# EAGLE design control_board_SMD (EAGLE 8.3.1)
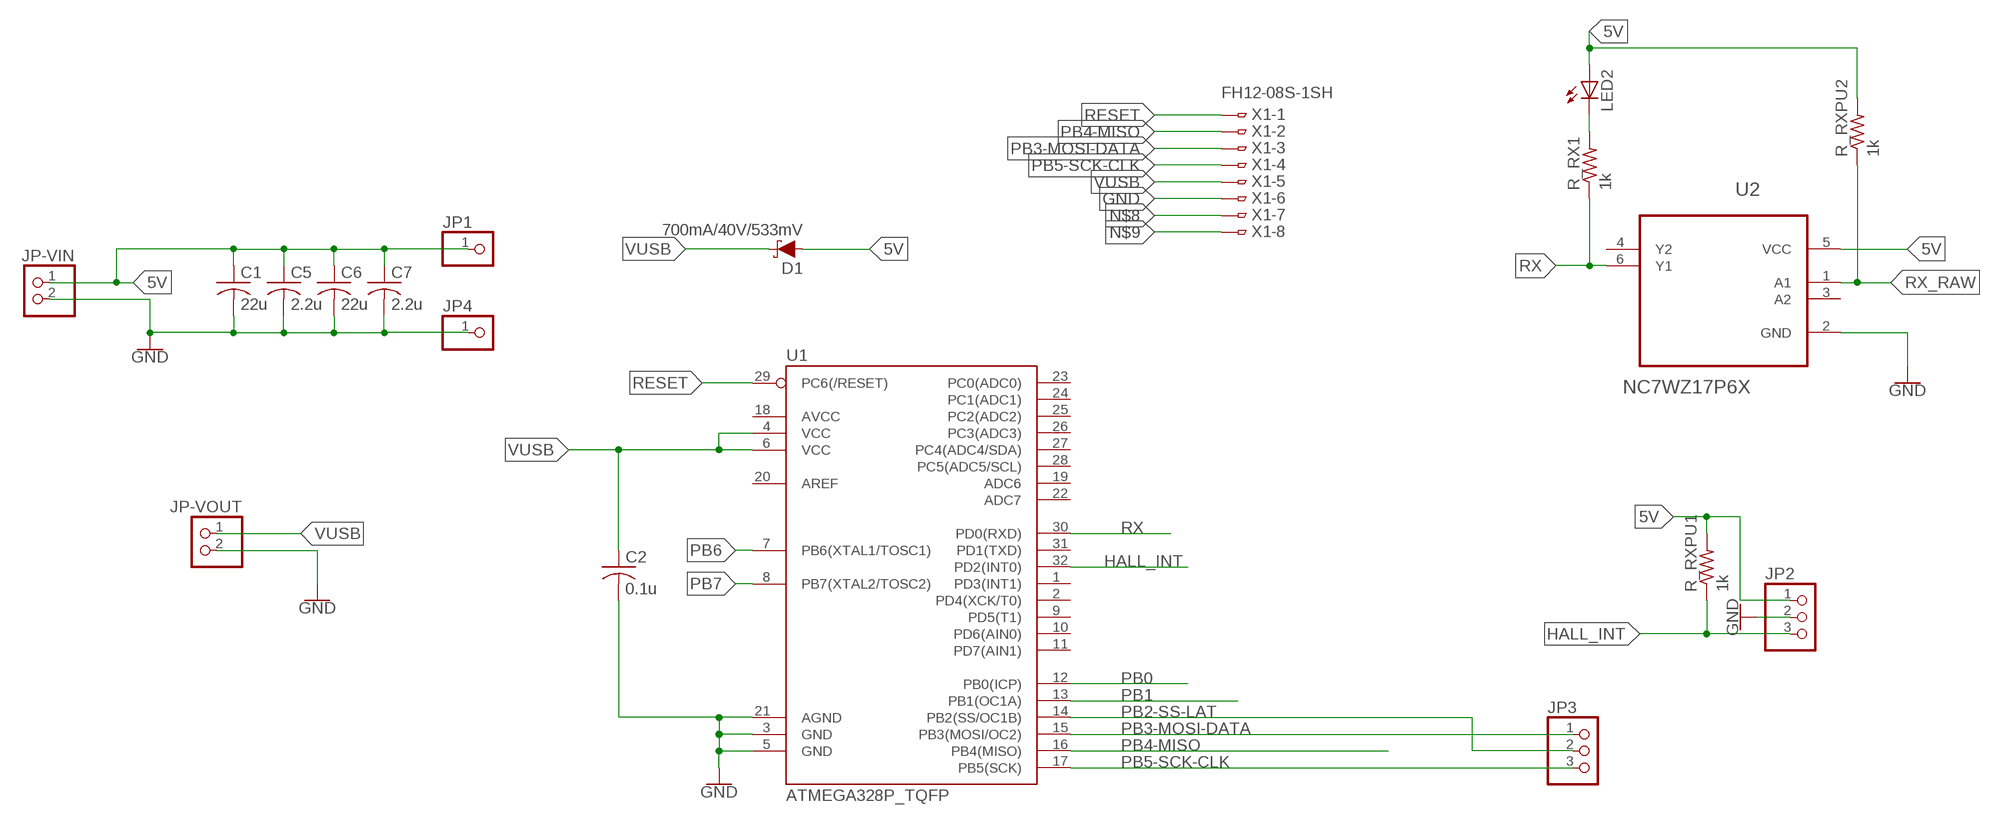
[diagram p0: schematic, sheet 1]

## Parts
C1  22u  C-USC1210  [C1210]
C2  0.1u  C-USC0603  [C0603]
C5  2.2u  C-USC1210  [C1210]
C6  22u  C-USC1210  [C1210]
C7  2.2u  C-USC1210  [C1210]
D1  700mA/40V/533mV  DIODE-SCHOTTKY-ZLLS500  [SOT23-3]
JP1  PINHD-1X1  [1X01]
JP2  PINHD-1X3  [1X03]
JP3  PINHD-1X3  [1X03]
JP4  PINHD-1X1  [1X01]
JP-VIN  PINHD-1X2  [1X02]
JP-VOUT  PINHD-1X2  [1X02]
LED2  LEDCHIPLED_0603  [CHIPLED_0603]
R_RX1  1k  R-US_R0603  [R0603]
R_RXPU1  1k  R-US_R0603  [R0603]
R_RXPU2  1k  R-US_R0603  [R0603]
U1  ATMEGA328P_TQFP  [TQFP32-08]
U2  NC7WZ17P6X  [SOT65P210X110-6N]
X1  FH12-08S-1SH  [FH12-08S-1SH]

## Nets
5V: C1.1 C5.1 C6.1 C7.1 D1.1(A) JP1.1 JP2.1 JP-VIN.1 LED2.A R_RXPU1.2 R_RXPU2.2 U2.5(VCC)
GND: C1.2 C2.2 C5.2 C6.2 C7.2 JP2.2 JP4.1 JP-VIN.2 JP-VOUT.2 U1.3(GND) U1.5(GND) U1.21(AGND) U2.2(GND) X1.6
HALL_INT: JP2.3 R_RXPU1.1 U1.32(PD2(INT0))
N$2: LED2.C R_RX1.2
N$8: X1.7
N$9: X1.8
PB0: U1.12(PB0(ICP))
PB1: U1.13(PB1(OC1A))
PB2-SS-LAT: JP3.2 U1.14(PB2(SS/OC1B))
PB3-MOSI-DATA: JP3.1 U1.15(PB3(MOSI/OC2)) X1.3
PB4-MISO: U1.16(PB4(MISO)) X1.2
PB5-SCK-CLK: JP3.3 U1.17(PB5(SCK)) X1.4
PB6: U1.7(PB6(XTAL1/TOSC1))
PB7: U1.8(PB7(XTAL2/TOSC2))
RESET: U1.29(PC6(/RESET)) X1.1
RX: R_RX1.1 U1.30(PD0(RXD)) U2.6(Y1)
RX_RAW: R_RXPU2.1 U2.1(A1)
VUSB: C2.1 D1.3(C) JP-VOUT.1 U1.4(VCC) U1.6(VCC) X1.5
Unconnected: U1.1(PD3(INT1)) U1.2(PD4(XCK/T0)) U1.9(PD5(T1)) U1.10(PD6(AIN0)) U1.11(PD7(AIN1)) U1.18(AVCC) U1.19(ADC6) U1.20(AREF) U1.22(ADC7) U1.23(PC0(ADC0)) U1.24(PC1(ADC1)) U1.25(PC2(ADC2)) U1.26(PC3(ADC3)) U1.27(PC4(ADC4/SDA)) U1.28(PC5(ADC5/SCL)) U1.31(PD1(TXD)) U2.3(A2) U2.4(Y2)

## Library data of the parts
C1 C2 C5-C7 = adafruit:C-US: CAPACITOR, American symbol
D1 = SparkFun-DiscreteSemi:DIODE-SCHOTTKY: Schottky diode A Schottky diode is a semiconductor diode which has a low forward voltage drop and a very fast switching action.; PROD_ID: DIO-08411
JP1 JP4 = pinhead:PINHD-1X1: PIN HEADER
JP2 JP3 = pinhead:PINHD-1X3: PIN HEADER
JP-VIN JP-VOUT = pinhead:PINHD-1X2: PIN HEADER
LED2 = adafruit:LED: LED OSRAM: - CHIPLED LG R971, LG N971, LY N971, LG Q971, LY Q971, LO R971, LY R971 LH N974, LH R974 LS Q976, LO Q976, LY Q976 LO Q996 - Hyper CHIPLED LW Q18S LB Q993, LB Q99A, LB R99A - SideLED LS A670, LO A670, LY A670, LG A670, LP A670 LB A673, LV A673, LT A673, LW A673 LH A674 LY A675 LS A676, LA A676, LO A676, LY A676, LW A676 LS A679, LY A679, LG A679 - Hyper Micro SIDELED® LS Y876, LA Y876, LO Y876, LY Y876 LT Y87S - SmartLED LW L88C, LW L88S LB L89C, LB L89S, LG L890 LS L89K, LO L89K, LY L89K LS L896, LA L896, LO L896, LY L896 - TOPLED LS T670, LO T670, LY T670, LG T670, LP T670 LSG T670, LSP T670, LSY T670, LOP T670, LYG T670 LG T671, LOG T671, LSG T671 LB T673, LV T673, LT T673, LW T673 LH T674 LS T676, LA T676, LO T676, LY T676, LB T676, LH T676, LSB T676, LW T676 LB T67C, LV T67C, LT T67C, LS T67K, LO T67K, LY T67K, LW E67C LS E67B, LA E67B, LO E67B, LY E67B, LB E67C, LV E67C, LT E67C LW T67C LS T679, LY T679, LG T679 LS T770, LO T770, LY T770, LG T770, LP T770 LB T773, LV T773, LT T773, LW T773 LH T774 LS E675, LA E675, LY E675, LS T675 LS T776, LA T776, LO T776, LY T776, LB T776 LHGB T686 LT T68C, LB T68C - Hyper Mini TOPLED® LB M676 - Mini TOPLED Santana® LG M470 LS M47K, LO M47K, LY M47K Source: http://www.osram.convergy.de/
R_RX1 R_RXPU1 R_RXPU2 = adafruit:R-US_: RESISTOR, American symbol
U1 = SparkFun-IC-Microcontroller:ATMEGA328P_TQFP: Popular 328P in QFP Storefront component: ATmega328 - TQFP <https://www.sparkfun.com/products/13448> (COM-13448) Datasheet <http://www.sparkfun.com/datasheets/Components/SMD/ATMega328.pdf> SparkFun Products SparkFun RedBoard - Programmed with Arduino <https://www.sparkfun.com/products/12757> (DEV-12757) Arduino Pro Mini 328 - 5V/16MHz <https://www.sparkfun.com/products/11113> (DEV-11113) Arduino Pro Mini 328 - 3.3V/8MHz <https://www.sparkfun.com/products/11114> (DEV-11114) SparkFun OpenLog <https://www.sparkfun.com/products/13712> (DEV-13712) SparkFun MicroView - OLED Arduino Module <https://www.sparkfun.com/products/12923> (DEV-12923) SparkFun Digital Sandbox <https://www.sparkfun.com/products/12651> (DEV-12651) SparkFun PicoBoard <https://www.sparkfun.com/products/11888> (WIG-11888) Arduino Fio <https://www.sparkfun.com/products/10116> (DEV-10116) LilyPad Arduino 328 Main Board <https://www.sparkfun.com/products/13342> (DEV-13342) SparkFun RedStick <https://www.sparkfun.com/products/13741> (DEV-13741) LilyPad MP3 <https://www.sparkfun.com/products/11013> (DEV-11013) LilyPad Arduino SimpleSnap <https://www.sparkfun.com/products/10941> (DEV-10941) SparkFun Stepoko <https://www.sparkfun.com/products/13899> (ROB-13899) SparkFun Geiger Counter <https://www.sparkfun.com/products/11345> (SEN-11345) SparkFun EL Sequencer <https://www.sparkfun.com/products/12781> (COM-12781) Arduino Pro 328 - 5V/16MHz <https://www.sparkfun.com/products/10915> (DEV-10915) CryptoCape <https://www.sparkfun.com/products/12773> (DEV-12773) SparkFun IR Thermometer Evaluation Board - MLX90614 <https://www.sparkfun.com/products/10740> (SEN-10740) SparkFun RedBot Mainboard <https://www.sparkfun.com/products/12097> (ROB-12097) Arduino Pro 328 - 3.3V/8MHz <https://www.sparkfun.com/products/10914> (DEV-10914) SparkFun Block for Intel® Edison - Arduino <https://www.sparkfun.com/products/13036> (DEV-13036) SparkFun Simon Says - Surface Mount Soldering Kit <https://www.sparkfun.com/products/10935> (KIT-10935) SparkFun 7-Segment Serial Display - Red <https://www.sparkfun.com/products/11441> (COM-11441) SparkFun 7-Segment Serial Display - White <https://www.sparkfun.com/products/11629> (COM-11629) SparkFun 7-Segment Serial Display - Yellow <https://www.sparkfun.com/products/11443> (COM-11443) SparkFun 7-Segment Serial Display - Kelly Green <https://www.sparkfun.com/products/11440> (COM-11440) SparkFun 7-Segment Serial Display - Blue <https://www.sparkfun.com/products/11442> (COM-11442) SparkFun OpenSegment Serial Display - 20mm (Blue) <https://www.sparkfun.com/products/11647> (COM-11647) SparkFun OpenSegment Serial Display - 20mm (Green) <https://www.sparkfun.com/products/11646> (COM-11646) SparkFun OpenSegment Serial Display - 20mm (White) <https://www.sparkfun.com/products/11648> (COM-11648) SparkFun OpenSegment Serial Display - 20mm (Red) <https://www.sparkfun.com/products/11644> (COM-11644) SparkFun OpenSegment Serial Display - 20mm (Yellow) <https://www.sparkfun.com/products/11645> (COM-11645) SparkFun OpenSegment Shield <https://www.sparkfun.com/products/13190> (DEV-13190); PROD_ID: IC-09069
U2 = NC7WZ17P6X:NC7WZ17P6X: Dual Buffer; AVAILABILITY: Good; DESCRIPTION: NC7WZ17 Series 5.5 V TinyLogic UHS Dual Buffer w/ Schmitt Trigger Inputs-SC-70-6; MF: Fairchild Semiconductor; MP: NC7WZ17P6X; PACKAGE: SC-70-6 Fairchild Semiconductor; PRICE: 0.10 USD
X1 = con-hirose:FH12-08S-1S: 1mm Pitch Connectors For FPC/FFC Source: Data sheet <http://www.hirose.co.jp/cataloge_hp/e58605370.pdf>; OC_FARNELL: unknown; OC_NEWARK: unknown

## Board
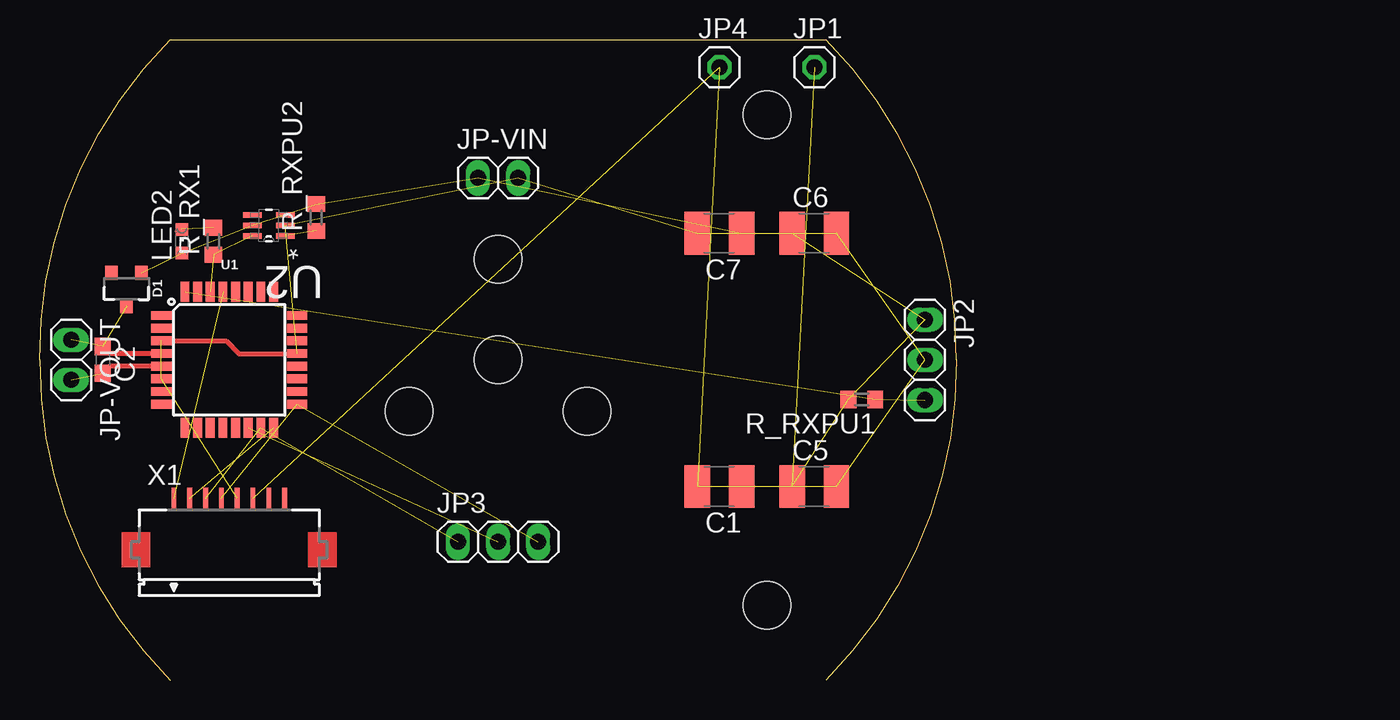
[diagram p1: board, top side]
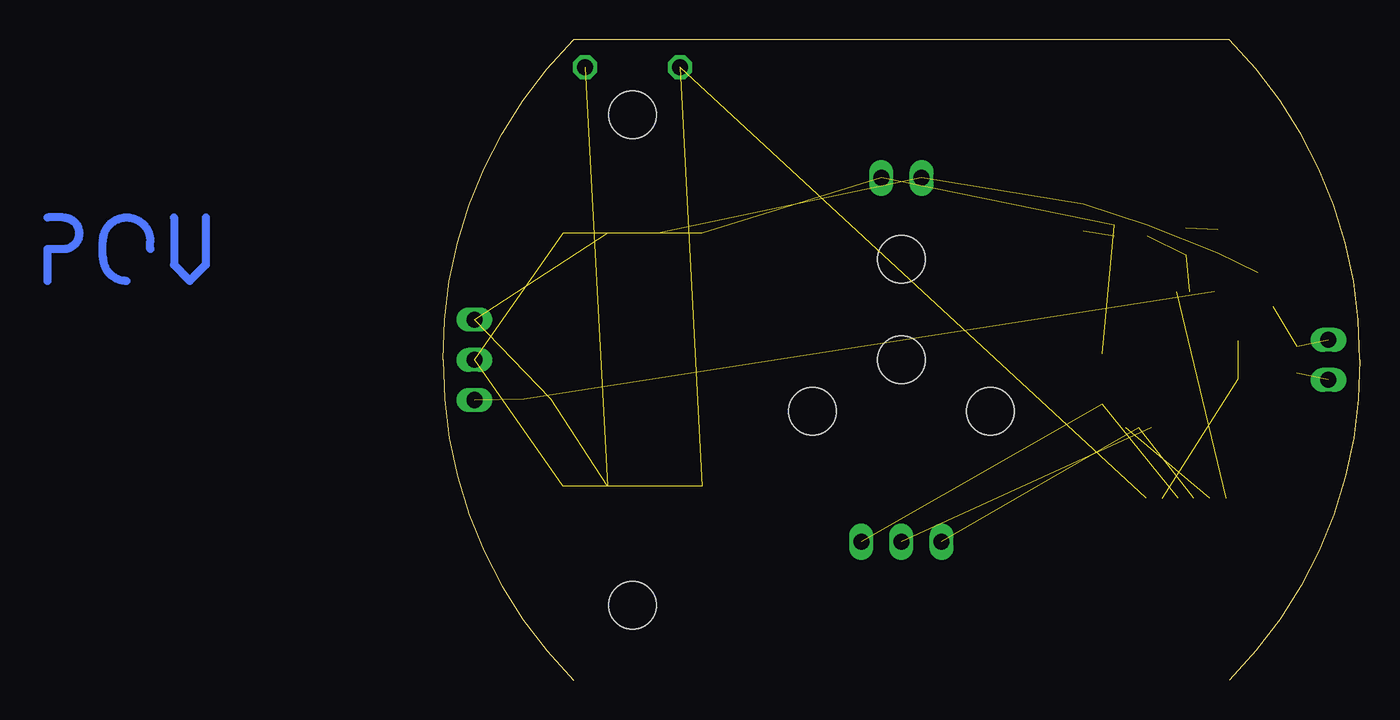
[diagram p2: board, bottom side, seen from below]

Size 58 x 40.5 mm. Coordinates in mm from the lower left corner, seen from the top.
Outline: 8.25,0 arc-45 0,20.25 arc-45 8.25,40.5 49.75,40.5 arc-45 58,20.25 arc-45 49.75,0
Copper layers (1*16): Top 0.035mm / dielectric 1.5mm / Bottom 0.035mm
Design rules "OthermillDRC_1_32_v2": minimum track width 8mil, minimum drill 0.8mm, track to track 0.794003125mm, track to pad 0.794003125mm, pad to pad 0.794003125mm, via to via 0.794003125mm, smd to smd 0mil, copper to edge 0mil, drill to drill 1mil, minimum pad ring 10mil, minimum via ring 10mil, stop-mask expansion 1mil, vias tented up to drill 30mil, thermal gap 10mil
Holes 3 mm at 29,20.25 29,26.6 34.63,17 23.37,17 46,35.75 46,4.75

### Footprints (pad centres in the part's own frame; a part is rotated, then mirrored left to right if it is on the bottom)
C1210 = smd 1.6 x 2.7: 1 -1.4,0; 2 1.4,0
C0603 = smd 1.1 x 1: 1 -0.85,0; 2 0.85,0
SOT23-3 = smd 0.8 x 0.9: 1 -0.95,-1; 2 0.95,-1; 3 0,1.1
1X01 = drill 1.016 octagon: 1 0,0
1X03 = drill 1.016 long: 1 -2.54,0; 2 0,0; 3 2.54,0
1X02 = drill 1.016 long: 1 -1.27,0; 2 1.27,0
CHIPLED_0603 = smd 0.8 x 0.8: A 0,-0.75; C 0,0.75
R0603 = smd 1 x 1.1: 1 -0.85,0; 2 0.85,0
TQFP32-08 = smd 1.27 x 0.559: 1 -4.293,2.8; 2 -4.293,2; 3 -4.293,1.2; 4 -4.293,0.4; 5 -4.293,-0.4; 6 -4.293,-1.2; 7 -4.293,-2; 8 -4.293,-2.8; 17 4.293,-2.8; 18 4.293,-2; 19 4.293,-1.2; 20 4.293,-0.4; 21 4.293,0.4; 22 4.293,1.2; 23 4.293,2; 24 4.293,2.8 | smd 0.559 x 1.27: 9 -2.8,-4.293; 10 -2,-4.293; 11 -1.2,-4.293; 12 -0.4,-4.293; 13 0.4,-4.293; 14 1.2,-4.293; 15 2,-4.293; 16 2.8,-4.293; 25 2.8,4.293; 26 2,4.293; 27 1.2,4.293; 28 0.4,4.293; 29 -0.4,4.293; 30 -1.2,4.293; 31 -2,4.293; 32 -2.8,4.293
SOT65P210X110-6N = smd 1.168 x 0.356: 1 -1.041,0.66; 2 -1.041,0; 3 -1.041,-0.66; 4 1.041,-0.66; 5 1.041,0; 6 1.041,0.66
FH12-08S-1SH = smd 0.3 x 1.3: 1 -3.5,3.25; 2 -2.5,3.25; 3 -1.5,3.25; 4 -0.5,3.25; 5 0.5,3.25; 6 1.5,3.25; 7 2.5,3.25; 8 3.5,3.25

### Placement (x,y rotation side)
C1  43,12.25 180 top
C2  4,20.25 270 top
C5  49,12.25 0 top
C6  49,28.25 0 top
C7  43,28.25 180 top
D1  5.5,24.75 180 top
JP1  49,38.75 0 top
JP2  56,20.25 270 top
JP3  29,8.75 0 top
JP4  43,38.75 0 top
JP-VIN  29,31.75 0 top
JP-VOUT  2,20.25 270 top
LED2  9,27.75 0 top
R_RX1  11,27.75 90 top
R_RXPU1  52,17.75 180 top
R_RXPU2  17.5,29.25 90 top
U1  12,20.25 0 top
U2  14.5,28.75 180 top
X1  12,8.25 0 top

### Tracks (layer width: path | path; a pad name or v marks a point on that pad's centre or on a via)
5V  (11 unrouted)
GND  (11 unrouted)
  Top 0.305: U1.5 4.45,19.85 C2.2 | U1.21 12.6,20.65 11.8,21.45 U1.3
HALL_INT  (2 unrouted)
N$2  (1 unrouted)
O
  Bottom 0.508: 76.5,27.25 76.5,27.75 arc-90 78,29.25 arc-90 79.5,27.75 79.5,26.75 arc-90 78,25.25
P
  Bottom 0.508: 83,25.25 83,27.25 82,27.25 arc-90 81,28.25 arc-90 82,29.25 83,29.25
PB2-SS-LAT  (1 unrouted)
PB3-MOSI-DATA  (2 unrouted)
PB4-MISO  (1 unrouted)
PB5-SCK-CLK  (2 unrouted)
RESET  (1 unrouted)
RX  (2 unrouted)
RX_RAW  (1 unrouted)
V
  Bottom 0.508: 75,29.25 75,26.25 74,25.25 73,26.25 73,29.25
VUSB  (4 unrouted)
  Top 0.305: U1.4 4.45,20.65 C2.1